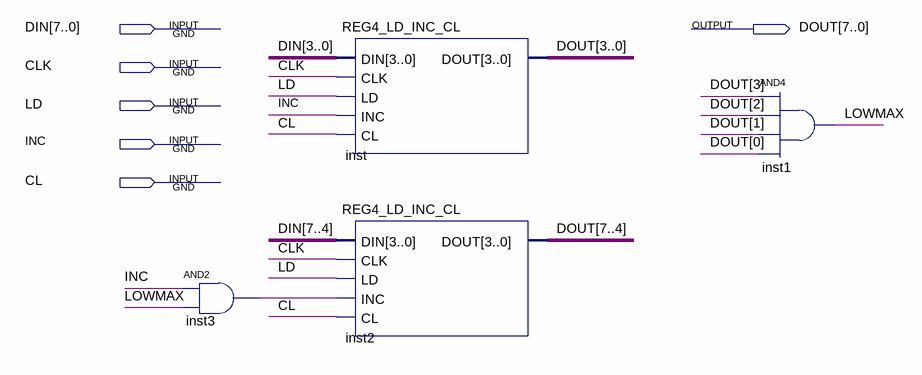
[diagram p0: schematic sheet]
// Quartus schematic REG8_LD_INC_CL.bdf as structural Verilog: 4 symbols, 6 pins
module REG8_LD_INC_CL (
  input  [7:0] DIN,
  input  CLK,
  input  LD,
  input  INC,
  input  CL,
  output [7:0] DOUT
);

  wire inst3_out, LOWMAX;

  and inst3 (inst3_out, INC, LOWMAX);
  REG4_LD_INC_CL inst (.DIN(DIN[3:0]), .CLK(CLK), .LD(LD), .INC(INC), .CL(CL), .DOUT(DOUT[3:0]));
  REG4_LD_INC_CL inst2 (.DIN(DIN[7:4]), .CLK(CLK), .LD(LD), .INC(inst3_out), .CL(CL), .DOUT(DOUT[7:4]));
  and inst1 (LOWMAX, DOUT[3], DOUT[2], DOUT[1], DOUT[0]);
endmodule
